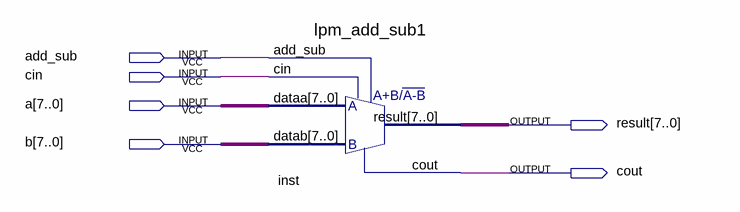
[diagram p0: schematic sheet]
// Quartus schematic ex7_28.bdf as structural Verilog: 1 symbols, 6 pins
module ex7_28 (
  input  add_sub,
  input  cin,
  input  [7:0] a,
  input  [7:0] b,
  output [7:0] result,
  output cout
);

  lpm_add_sub1 inst (.dataa(a), .datab(b), .add_sub(add_sub), .cin(cin), .result(result), .cout(cout));
endmodule
